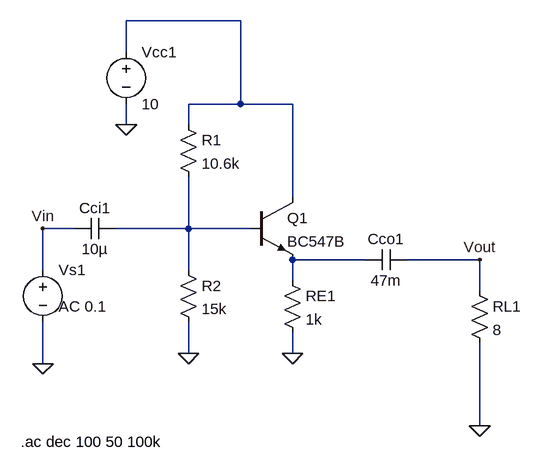
[diagram p0: schematic lab7.2a.asc]
lab7.2a.asc, the LTspice schematic file:
Version 4
SHEET 1 880 680
WIRE 160 -144 -16 -144
WIRE -16 -96 -16 -144
WIRE 160 -16 160 -144
WIRE 160 -16 80 -16
WIRE 240 -16 160 -16
WIRE -16 16 -16 -16
WIRE 80 16 80 -16
WIRE 240 128 240 -16
WIRE -96 176 -144 176
WIRE 80 176 80 96
WIRE 80 176 -32 176
WIRE 176 176 80 176
WIRE 352 224 240 224
WIRE 528 224 416 224
WIRE -144 240 -144 176
WIRE 80 240 80 176
WIRE 240 256 240 224
WIRE 528 272 528 224
WIRE 80 368 80 320
WIRE 240 368 240 336
WIRE -144 384 -144 320
WIRE 528 480 528 352
FLAG -144 384 0
FLAG 80 368 0
FLAG 240 368 0
FLAG 528 480 0
FLAG -16 16 0
FLAG 528 224 Vout
FLAG -144 176 Vin
SYMBOL voltage -144 224 R0
WINDOW 123 24 72 Left 2
WINDOW 39 0 0 Left 0
WINDOW 3 24 44 Left 2
SYMATTR Value2 AC 0.1
SYMATTR InstName Vs1
SYMATTR Value ""
SYMBOL res 64 0 R0
SYMATTR InstName R1
SYMATTR Value 10.6k
SYMBOL res 64 224 R0
SYMATTR InstName R2
SYMATTR Value 15k
SYMBOL res 224 240 R0
SYMATTR InstName RE1
SYMATTR Value 1k
SYMBOL cap 416 208 R90
WINDOW 0 0 32 VBottom 2
WINDOW 3 32 32 VTop 2
SYMATTR InstName Cco1
SYMATTR Value 47m
SYMBOL res 512 256 R0
SYMATTR InstName RL1
SYMATTR Value 8
SYMBOL npn 176 128 R0
SYMATTR InstName Q1
SYMATTR Value BC547B
SYMBOL voltage -16 -112 R0
SYMATTR InstName Vcc1
SYMATTR Value 10
SYMBOL cap -32 160 R90
WINDOW 0 0 32 VBottom 2
WINDOW 3 32 32 VTop 2
SYMATTR InstName Cci1
SYMATTR Value 10µ
TEXT -178 504 Left 2 !.ac dec 100 50 100k

The netlist it stands for:
* lab7.2a.asc
Vs1 Vin 0 AC 0.1
R1 N001 N002 10.6k
R2 N002 0 15k
RE1 N003 0 1k
Cco1 Vout N003 47m
RL1 Vout 0 8
Q1 N001 N002 N003 0 BC547B
Vcc1 N001 0 10
Cci1 N002 Vin 10µ
.model NPN NPN
.model PNP PNP
.lib standard.bjt
.ac dec 100 50 100k
.backanno
.end